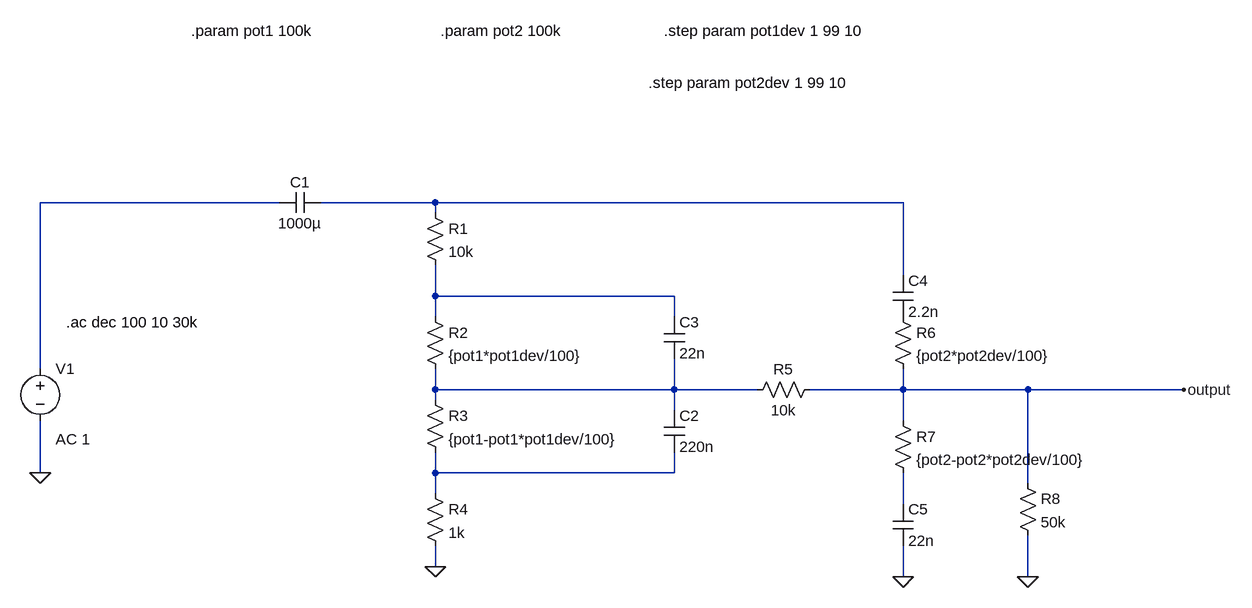
[diagram p0: schematic baxandall tone control.asc]
baxandall tone control.asc, the LTspice schematic file:
Version 4
SHEET 1 1920 680
WIRE 432 -112 64 -112
WIRE 672 -112 496 -112
WIRE 1392 -112 672 -112
WIRE 672 -96 672 -112
WIRE 1392 0 1392 -112
WIRE 672 32 672 -16
WIRE 1040 32 672 32
WIRE 672 64 672 32
WIRE 1040 64 1040 32
WIRE 64 144 64 -112
WIRE 672 176 672 144
WIRE 1040 176 1040 128
WIRE 1040 176 672 176
WIRE 1168 176 1040 176
WIRE 1392 176 1392 144
WIRE 1392 176 1248 176
WIRE 1584 176 1392 176
WIRE 1824 176 1584 176
WIRE 672 192 672 176
WIRE 1040 208 1040 176
WIRE 1392 224 1392 176
WIRE 64 304 64 224
WIRE 672 304 672 272
WIRE 1040 304 1040 272
WIRE 1040 304 672 304
WIRE 1584 320 1584 176
WIRE 672 336 672 304
WIRE 1392 352 1392 304
WIRE 672 448 672 416
WIRE 1392 464 1392 416
WIRE 1584 464 1584 400
FLAG 64 304 0
FLAG 672 448 0
FLAG 1392 464 0
FLAG 1584 464 0
FLAG 1824 176 output
SYMBOL voltage 64 128 R0
WINDOW 123 24 124 Left 2
WINDOW 39 0 0 Left 0
SYMATTR Value2 AC 1
SYMATTR InstName V1
SYMATTR Value ""
SYMBOL cap 496 -128 R90
WINDOW 0 0 32 VBottom 2
WINDOW 3 32 32 VTop 2
SYMATTR InstName C1
SYMATTR Value 1000µ
SYMBOL res 656 -112 R0
SYMATTR InstName R1
SYMATTR Value 10k
SYMBOL res 656 48 R0
SYMATTR InstName R2
SYMATTR Value {pot1*pot1dev/100}
SYMBOL res 656 176 R0
SYMATTR InstName R3
SYMATTR Value {pot1-pot1*pot1dev/100}
SYMBOL res 656 320 R0
SYMATTR InstName R4
SYMATTR Value 1k
SYMBOL cap 1024 208 R0
SYMATTR InstName C2
SYMATTR Value 220n
SYMBOL cap 1024 64 R0
SYMATTR InstName C3
SYMATTR Value 22n
SYMBOL res 1264 160 R90
WINDOW 0 0 56 VBottom 2
WINDOW 3 32 56 VTop 2
SYMATTR InstName R5
SYMATTR Value 10k
SYMBOL cap 1376 0 R0
SYMATTR InstName C4
SYMATTR Value 2.2n
SYMBOL res 1376 48 R0
SYMATTR InstName R6
SYMATTR Value {pot2*pot2dev/100}
SYMBOL res 1376 208 R0
SYMATTR InstName R7
SYMATTR Value {pot2-pot2*pot2dev/100}
SYMBOL cap 1376 352 R0
SYMATTR InstName C5
SYMATTR Value 22n
SYMBOL res 1568 304 R0
SYMATTR InstName R8
SYMATTR Value 50k
TEXT 296 -376 Left 2 !.param pot1 100k
TEXT 680 -376 Left 2 !.param pot2 100k
TEXT 1024 -376 Left 2 !.step param pot1dev 1 99 10
TEXT 1000 -296 Left 2 !.step param pot2dev 1 99 10
TEXT 104 72 Left 2 !.ac dec 100 10 30k

The netlist it stands for:
* baxandall tone control.asc
V1 N001 0 AC 1
C1 N002 N001 1000µ
R1 N002 N003 10k
R2 N003 N004 {pot1*pot1dev/100}
R3 N004 N005 {pot1-pot1*pot1dev/100}
R4 N005 0 1k
C2 N004 N005 220n
C3 N003 N004 22n
R5 output N004 10k
C4 N002 P001 2.2n
R6 P001 output {pot2*pot2dev/100}
R7 output N006 {pot2-pot2*pot2dev/100}
C5 N006 0 22n
R8 output 0 50k
.param pot1 100k
.param pot2 100k
.step param pot1dev 1 99 10
.step param pot2dev 1 99 10
.ac dec 100 10 30k
.backanno
.end